# Altium schematic sheet Antenna.SchDoc: GSM Antenna & Match Circuit
size 292 x 193 mm; SheetNumber: 8; SheetTotal: 9
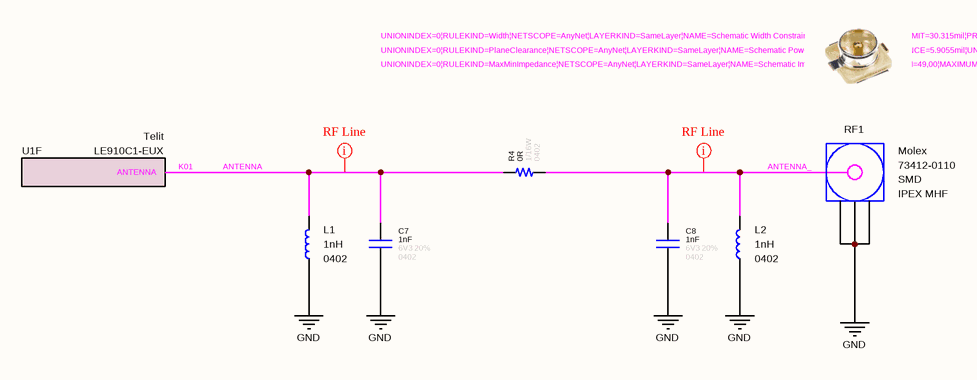
[diagram p0: Antenna.SchDoc]

## Parts
C7  value 1nF  Tolerance: 20%  Case: 0402  Voltage: 6V3  [CAPACITOR_0402]  (hidden comment: Capacitor - 1nF [0402] (Ceramic))
C8  value 1nF  Tolerance: 20%  Case: 0402  Voltage: 6V3  [CAPACITOR_0402]  (hidden comment: Capacitor - 1nF [0402] (Ceramic))
L1  value 1nH  Case: 0402  [INDUCTOR_0402]  (hidden comment: Fixed Inductor)
L2  value 1nH  Case: 0402  [INDUCTOR_0402]  (hidden comment: Fixed Inductor)
R4  value 0R  Case: 0402  Power: 1/16W  [RESISTOR_0402]  (hidden comment: 0R - 0402 - %1 - 1/16W)
RF1  Connector Type: IPEX MHF  Case: SMD  Manufacturer Name: Molex  [Connector_IPEX]  (hidden comment: 73412-0110)
U1  Manufacturer Part Number: LE910C1-EUX  Manufacturer Name: Telit  [LE910 GSM Modem]  (hidden comment: LE910C1-EUX LTE GSM Module)  (part F of 19)

## Nets
GND: C7.1 C8.1 L1.1 L2.1 RF1.2(GND) RF1.3(GND) RF1.4(GND)
ANTENNA: C7.2 L1.2 R4.2 U1.K01(ANTENNA)
ANTENNA_: C8.2 L2.2 R4.1 RF1.1(Signal)

## Layout directives
rule Impedance Constraint [Min = 49.00    Max = 50.00    ]; rule Power Plane Clearance [Clearance = 5.906mil]; rule Width Constraint [Pref Width = 0.77mm    Min Width = 0.77mm    Max Width = 0.77mm]: ANTENNA, ANTENNA_

## Notes on the sheet
- © 2026 All rights reserved.
  This document may not, in whole or in part, be copied, photocopied, reproduced, translated or converted to any electronic or machine readable from without prior written permission of Mehmet Günce Akkoyun.
  Engineer contact : akkoyun@me.com
- Property of
- Engineer :
- Date :
- Size :
- A4
- Time :
- Project :
- Page :
- /
- Customer :
- Product ID :
- Module ID :
- Version :
- File :
- Revision :

## Library data of the parts
C7 C8 = Capacitor - 1nF [0402-6V3]: Manufacturer Name: AVX; Manufacturer Part Number: 04026C102MAT2A; ComponentLink1Description: DataSheet; ComponentLink1URL: https://www.mouser.com.tr/datasheet/2/40/X7RDielectric-777024.pdf
L1 L2 = Inductor - 1nH [0402]: Manufacturer Name: Murata Electronics; Manufacturer Part Number: LQG15HN1N0S02D; Tolerance: 0.3 nH; Height: 0.35mm; ComponentLink1Description: DataSheet; ComponentLink1URL: https://www.mouser.com.tr/datasheet/2/281/JELF243B-0009-1699631.pdf
R4 = Resistor - 0R [0402]: Thick Film Resistors - SMD 1/16 W 0 Ohm; Manufacturer Name: Vishay; Manufacturer Part Number: CRCW04020000Z0ED; ComponentLink1Description: DataSheet; ComponentLink1URL: https://www.mouser.com.tr/datasheet/2/427/dcrcwe3-1762152.pdf; ComponentLink2Description: Mouser; ComponentLink2URL: https://www.mouser.com.tr/ProductDetail/Vishay-Dale/CRCW04020000Z0ED?qs=sGAEpiMZZMu61qfTUdNhG2DpbjADlD3GG34cJb50zyg%3D
RF1 = Connector - IPEX MHF: MOLEX   73412-0110   RF COAXIAL, MICROCOAXIAL, JACK, 50OHM; ROHS: Yes; Product Type: RF Connectors; Impedance: 50 Ohm; System: Connector; Manufacturer Part Number: 73412-0110
U1 = IC - LE910C1-EUX: Telit LE910C1-EUX LTE/2G GSM Module; Case: BGA